# EAGLE schematic Odessa_Add_el (EAGLE 7.0.0)
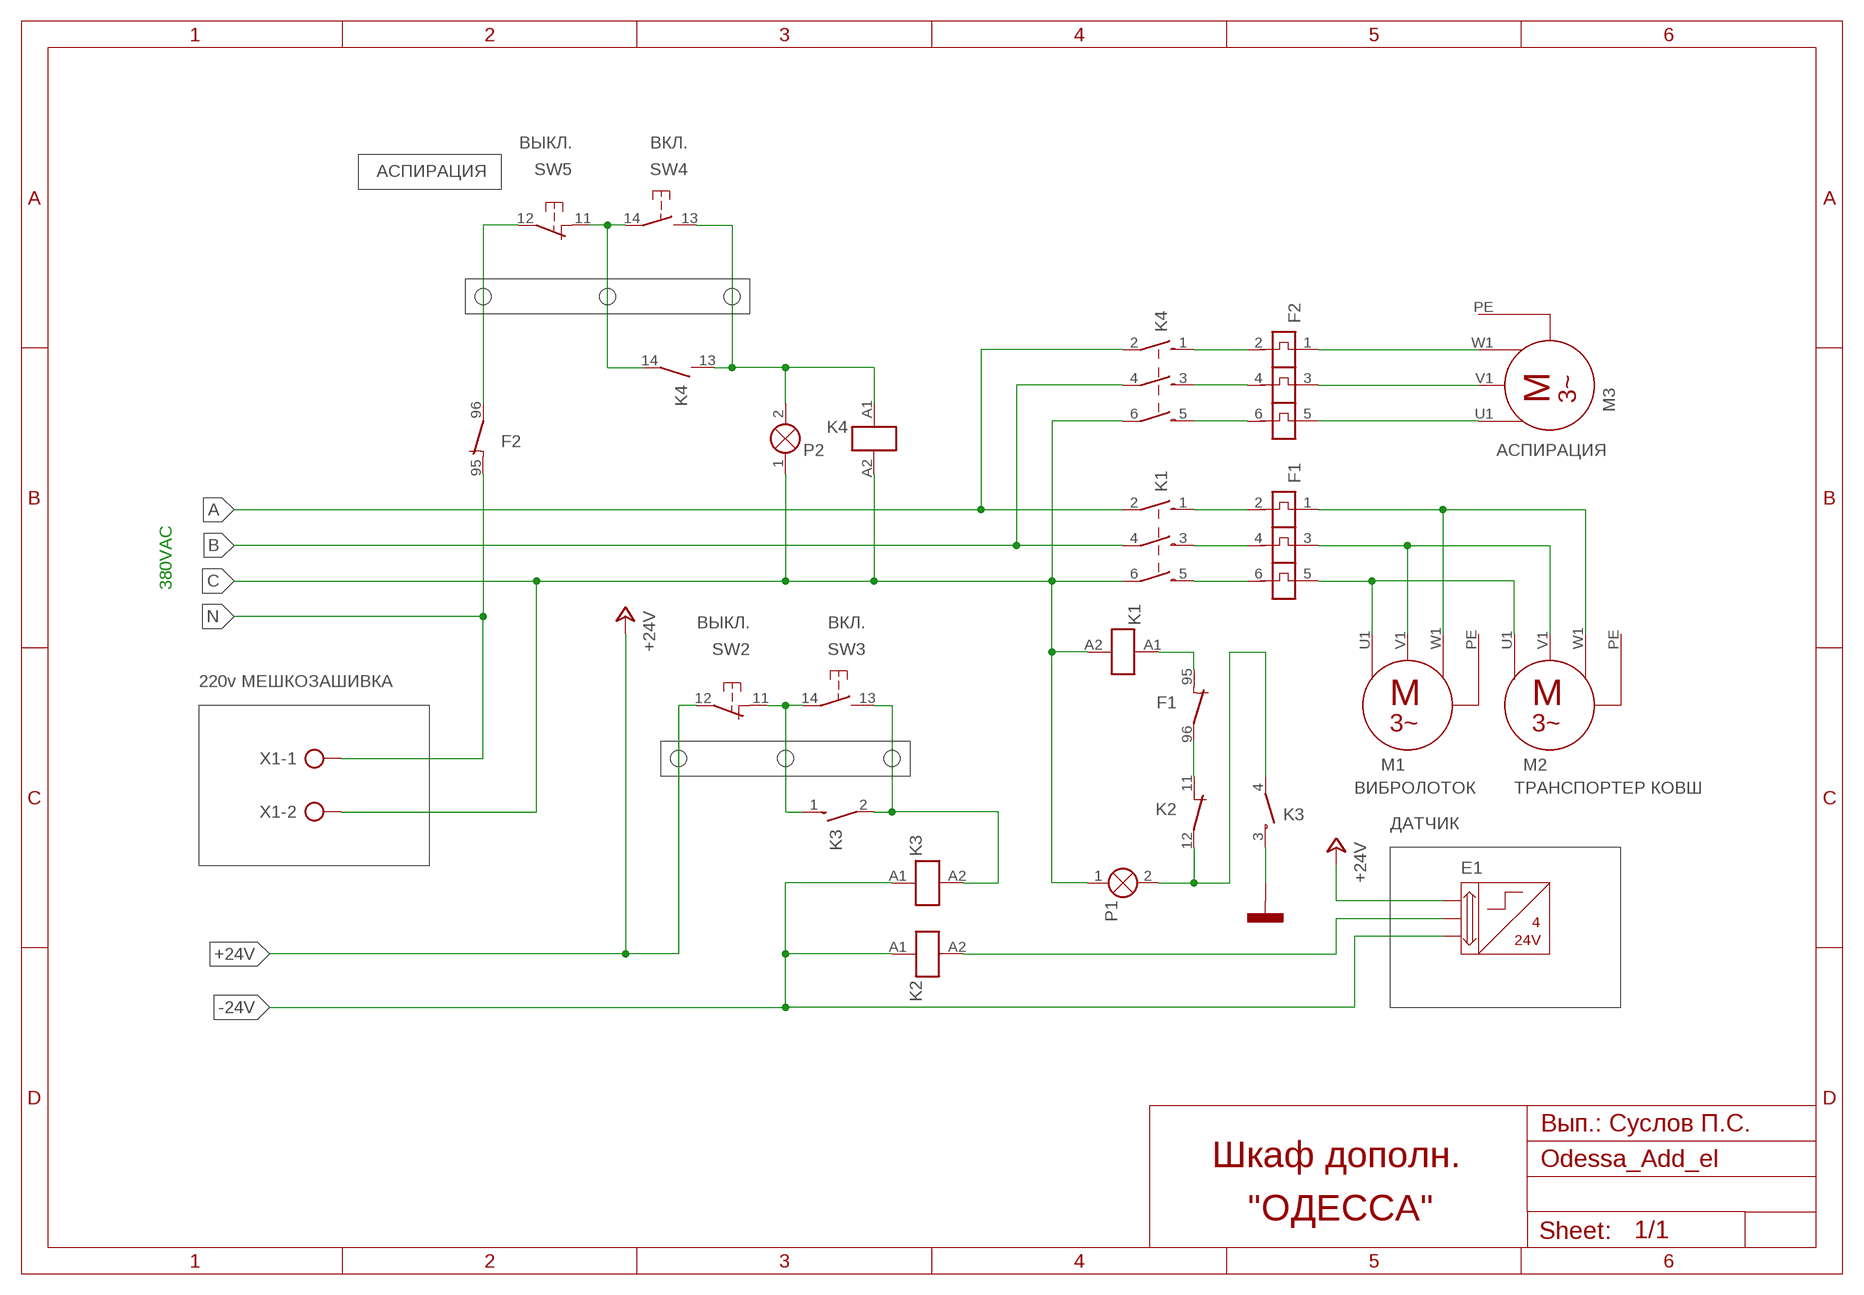
[diagram p0: schematic, sheet 1]

## Parts
E1  6158EB  [6158EB]
F1  MOTORSCHUTZSCHALTER_3-POL_THERM_AUSLOESUNG_HILFSKONTAKTE  [MOTORSCHUTZSCHALTER_3-POL_THERM_AUSLOESUNG_HILFSKONTAKT_95_96_97_98]
F2  MOTORSCHUTZSCHALTER_3-POL_THERM_AUSLOESUNG_HILFSKONTAKTE  [MOTORSCHUTZSCHALTER_3-POL_THERM_AUSLOESUNG_HILFSKONTAKT_95_96_97_98]
K1  HAUPTSCHUETZ_3-POL  [HAUPTSCHUETZ_3-POL]
K2  HILFSSCHUETZ_11-12  [HILFSSCHUETZ_11-12]
K3  HAUPTSCHUETZ_2-POL  [HAUPTSCHUETZ_2-POL]
K4  HAUPTSCHUETZ_3-POL_HILFSKONTAKT_13-14  [HAUPTSCHUETZ_3-POL+HILFSKONTAKT_13-14]
M1  MOTOR_3-POL_PE  [MOTOR_3-POL_PE]
M2  MOTOR_3-POL_PE  [MOTOR_3-POL_PE]
M3  MOTOR_3-POL_PE  [MOTOR_3-POL_PE]
P1  SIGNALLAMPE  [LAMPE]
P2  SIGNALLAMPE  [LAMPE]
SW2  ВЫКЛ.  OEFFNER_TASTSCHALTER  [OEFFNER_TASTSCHALTER]
SW3  ВКЛ.  SCHLIESSER_TASTSCHALTER  [SCHLIESSER_TASTSCHALTER]
SW4  ВКЛ.  SCHLIESSER_TASTSCHALTER  [SCHLIESSER_TASTSCHALTER]
SW5  ВЫКЛ.  OEFFNER_TASTSCHALTER  [OEFFNER_TASTSCHALTER]
X1  AK500/2  [AK500/2]
X4  MASSE_ALLGEMEIN  [MASSE_ALLGEMEIN]

## Nets
+24V: SW2.12
-24V: K2.A1 K3.A1(1:A1)
A: K1.2 K4.2
B: K1.4 K4.4
C: K1.6 K1.A2 K4.6 K4.A2(1:A2) P1.1(X1) P2.1(X1) X1.2
N: F2.95 X1.1
N$1: F1.96 K2.11
N$2: F1.6 K1.5
N$3: F1.4 K1.3
N$4: E1.1 K2.A2
N$5: K3.2 K3.A2(1:A2) SW3.13
N$6: K3.1 SW2.11 SW3.14
N$7: F1.2 K1.1
N$8: F2.6 K4.5
N$9: F2.4 K4.3
N$10: F2.2 K4.1
N$11: F2.1 M3.W1
N$12: F2.3 M3.V1
N$13: F2.5 M3.U1
N$14: K4.13 K4.A1(1:A1) P2.2(X2) SW4.13
N$16: F2.96 SW5.12
N$17: K4.14 SW4.14 SW5.11
N$26: F1.5 M1.U1 M2.U1
N$27: F1.3 M1.V1 M2.V1
N$28: F1.1 M1.W1 M2.W1
N$29: F1.95 K1.A1
N$30: K2.12 K3.4 P1.2(X2)
N$31: K3.3 X4.1(0V)
Unconnected: F1.97 F1.98 F2.97 F2.98 M1.PE M2.PE M3.PE

## Notes on the sheet
- АСПИРАЦИЯ
- АСПИРАЦИЯ
- 380VAC
- 220v МЕШКОЗАШИВКА
- ВИБРОЛОТОК | ТРАНСПОРТЕР КОВШ
- ДАТЧИК
- Вып.: Суслов П.С.
- Шкаф дополн.
- "ОДЕССА"

## Library data of the parts
E1 = eib-busch-jaeger:6158EB: Binäreingang 4-fach Source: http://www.busch-jaeger-katalog.de http://www.busch-jaeger.de/de/elektroplaner/cad-symbole.htm
F1 F2 = e-motorschutzschalter:MOTORSCHUTZSCHALTER_3-POL_THERM_AUSLOESUNG_HILFSKONTAKTE: Motorschutzschalter 3-pol. mit thermischer Auslösung, Hilfskontakte
K1 = e-schuetze-relais:HAUPTSCHUETZ_3-POL: Hauptschütz mit 3 Schließern
K2 = e-schuetze-relais:HILFSSCHUETZ_11-12: Hilfsschütz mit 1 Öffner
K3 = e-schuetze-relais:HAUPTSCHUETZ_2-POL: Hauptschütz mit 2 Schließern
K4 = e-schuetze-relais:HAUPTSCHUETZ_3-POL_HILFSKONTAKT_13-14: Hauptschütz 3-pol. mit Hilfskontakt-Schließer
M1-M3 = e-motoren:MOTOR_3-POL_PE: 3-Phasen-Motor mit PE
P1 P2 = e-lampen-signalisation:SIGNALLAMPE: Lampe
SW2 SW5 = e-schalter:OEFFNER_TASTSCHALTER: Tastschalter, Öffner
SW3 SW4 = e-schalter:SCHLIESSER_TASTSCHALTER: Tastschalter, Schließer
X1 = con-ptr500:AK500/2: CONNECTOR; OC_FARNELL: unknown; OC_NEWARK: unknown
X4 = e-klemmen:MASSE_ALLGEMEIN: Masse allgemein